# EAGLE design namcogunpcb (EAGLE 9.4.2)
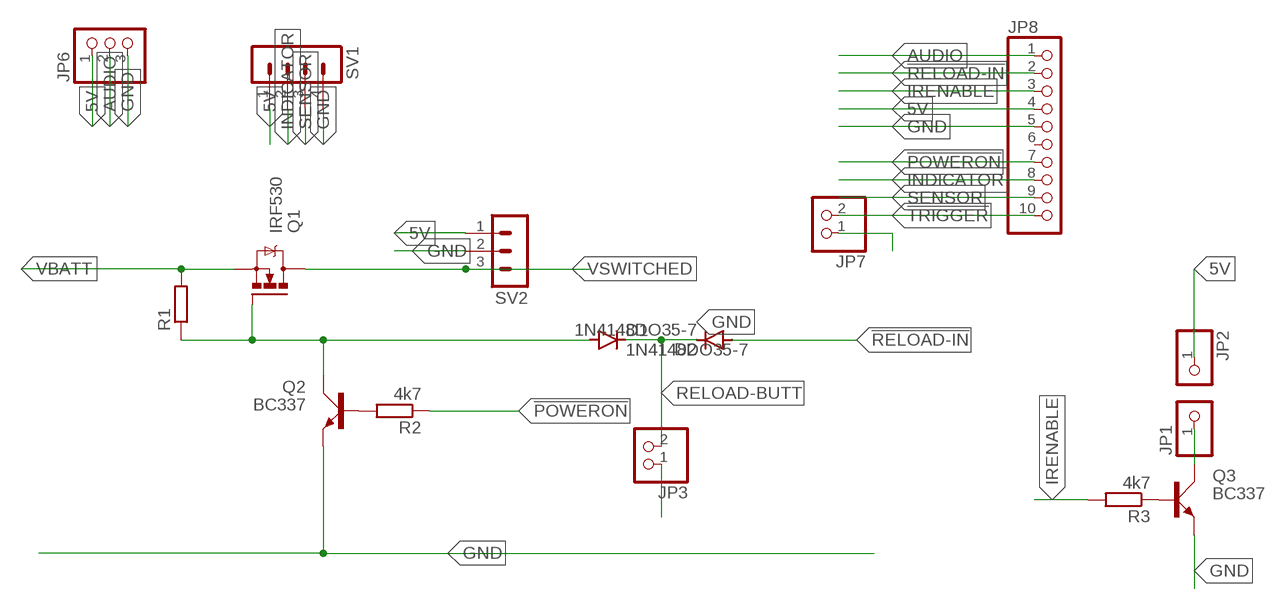
[diagram p0: schematic, sheet 1]

## Parts
D1  1N4148DO35-7  [DO35-7]
D2  1N4148DO35-7  [DO35-7]
JP1  PINHD-1X1  [1X01]
JP2  PINHD-1X1  [1X01]
JP3  PINHD-1X2  [1X02]
JP6  PINHD-1X3  [1X03]
JP7  PINHD-1X2  [1X02]
JP8  PINHD-1X10  [1X10]
Q1  IRF530  [TO220BV]
Q2  BC337  [SOT54A]
Q3  BC337  [SOT54A]
R1  R-EU_0207/10  [0207/10]
R2  4k7  R-EU_0207/10  [0207/10]
R3  4k7  R-EU_0207/10  [0207/10]
SV1  MA04-1  [MA04-1]
SV2  MA03-1  [MA03-1]

## Nets
5V: JP2.1 JP6.1 JP8.4 SV1.1 SV2.1
!POWERON: JP8.7 R2.1
!RELOAD-IN: D2.A JP8.2
!TRIGGER: JP7.2 JP8.10
AUDIO: JP6.2 JP8.1
GND: JP3.1 JP6.3 JP7.1 JP8.5 Q2.E Q3.E SV1.4 SV2.2
INDICATOR: JP8.8 SV1.2
IRENABLE: JP8.3 R3.2
N$1: JP1.1 Q3.C
N$2: D1.A Q1.G Q2.C R1.1
N$3: Q3.B R3.1
N$4: Q2.B R2.2
RELOAD-BUTT: D1.C D2.C JP3.2
SENSOR: JP8.9 SV1.3
VBATT: Q1.S R1.2
VSWITCHED: Q1.D SV2.3
Unconnected: JP8.6

## Library data of the parts
D1 D2 = diode:1N4148: DIODE high speed (Philips)
JP1 JP2 = pinhead:PINHD-1X1: PIN HEADER
JP3 JP7 = pinhead:PINHD-1X2: PIN HEADER
JP6 = adafruit:PINHD-1X3: PIN HEADER
JP8 = pinhead:PINHD-1X10: PIN HEADER
Q1 = transistor-power:IRF530: HEXFET Power MOSFET
Q2 Q3 = transistor-small-signal:BC337: NPN TRANSISTOR
R1-R3 = resistor:R-EU_: RESISTOR, European symbol
SV1 = con-lstb:MA04-1: PIN HEADER; OC_FARNELL: unknown; OC_NEWARK: unknown
SV2 = con-lstb:MA03-1: PIN HEADER; OC_FARNELL: unknown; OC_NEWARK: unknown

## Board
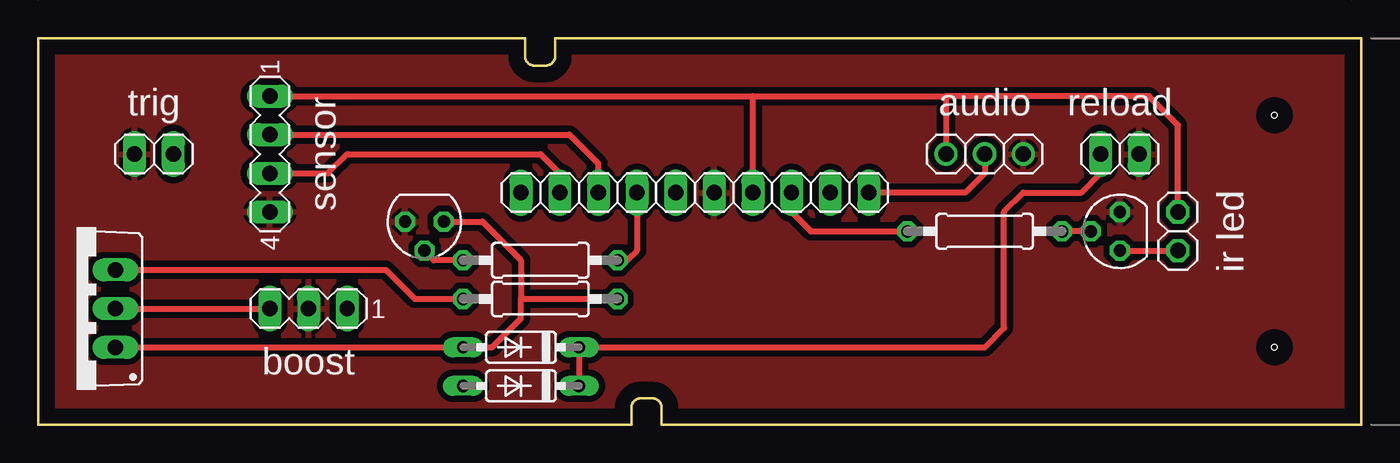
[diagram p1: board, top side]
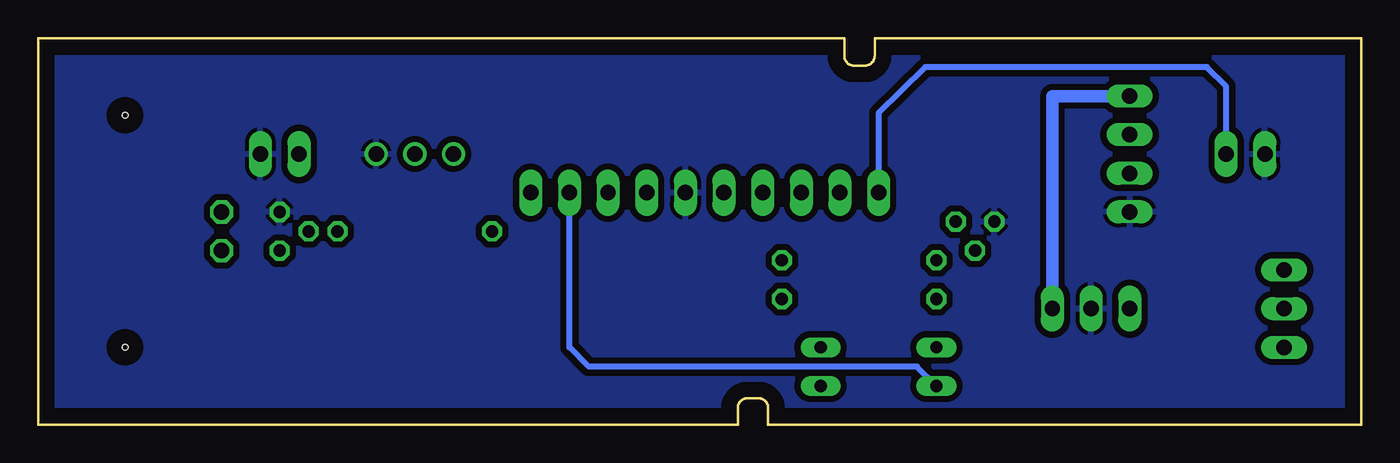
[diagram p2: board, bottom side, seen from below]

Size 87 x 25.4 mm. Coordinates in mm from the lower left corner, seen from the top.
Outline: 0,0 39,0 39,1.09 arc-90 39.63,1.73 40.37,1.73 arc-90 41,1.09 41,0 87,0 87,25.4 34,25.4 34,24.22 arc-90 33.37,23.59 32.63,23.59 arc-90 32,24.22 32,25.4 0,25.4 0,0
Copper layers (1*16): Top 0.035mm / dielectric 1.5mm / Bottom 0.035mm
Design rules "default": minimum track width 6mil, minimum drill 0.35mm, track to track 6mil, track to pad 6mil, pad to pad 6mil, via to via 6mil, smd to smd 6mil, copper to edge 40mil, drill to drill 6mil, minimum pad ring 10mil, minimum via ring 8mil, stop-mask expansion 4mil, vias tented up to drill 0mil, thermal gap 10mil
Holes 0.35 mm at 81.28,20.32 81.28,5.08

### Footprints (pad centres in the part's own frame; a part is rotated, then mirrored left to right if it is on the bottom)
DO35-7 = drill 0.813 long: A 3.81,0; C -3.81,0
1X01 = drill 1.016 octagon: 1 0,0
1X02 = drill 1.016 long: 1 -1.27,0; 2 1.27,0
1X03 = drill 1.016: 1 -2.54,0; 2 0,0; 3 2.54,0
1X10 = drill 1.016 long: 1 -11.43,0; 2 -8.89,0; 3 -6.35,0; 4 -3.81,0; 5 -1.27,0; 6 1.27,0; 7 3.81,0; 8 6.35,0; 9 8.89,0; 10 11.43,0
TO220BV = drill 1.016 long: D 0,-2.54; G -2.54,-2.54; S 2.54,-2.54
SOT54A = drill 0.813 octagon: B 0,1.905; C -1.27,0; E 1.27,0
0207/10 = drill 0.813 octagon: 1 -5.08,0; 2 5.08,0
MA04-1 = drill 1.016 long: 1 -3.81,0; 2 -1.27,0; 3 1.27,0; 4 3.81,0
MA03-1 = drill 1.016 long: 1 -2.54,0; 2 0,0; 3 2.54,0

### Placement (x,y rotation side)
D1  31.75,5.08 180 top
D2  31.75,2.54 180 top
JP1  74.93,11.43 0 top
JP2  74.93,13.97 0 top
JP3  71.12,17.78 180 top
JP6  62.23,17.78 0 top
JP7  7.62,17.78 0 top
JP8  43.18,15.24 180 top
Q1  2.54,7.62 90 top
Q2  25.4,13.34 180 top
Q3  71.12,12.7 90 top
R1  33.02,8.26 180 top
R2  33.02,10.79 180 top
R3  62.23,12.7 180 top
SV1  15.24,17.78 270 top
SV2  17.78,7.62 180 top

### Tracks (layer width: path | path; a pad name or v marks a point on that pad's centre or on a via)
5V
  Top 0.406: JP2.1 74.93,19.68 73.03,21.59 59.69,21.59 | 59.69,21.59 JP6.1 | SV1.1 46.99,21.59 | JP8.4 46.99,21.59 | 46.99,21.59 59.69,21.59
  Bottom 0.813: SV1.1 20.32,21.59 SV2.1
!POWERON
  Top 0.406: R2.1 38.73,10.79 39.37,11.43 JP8.7
!RELOAD-IN
  Bottom 0.406: D2.A 29.21,3.81 50.8,3.81 52.07,5.08 JP8.2
!TRIGGER
  Bottom 0.406: JP7.2 8.89,22.23 10.16,23.5 28.67,23.5 31.75,20.45 JP8.10
AUDIO
  Top 0.406: JP6.2 62.23,16.51 60.96,15.24 JP8.1
GND
  pour Top (isolate 0.406): 0,25.4 86.36,25.4 86.36,0 0,0
  pour Bottom (isolate 0.406): 0,25.4 86.36,25.4 86.36,0 0,0
INDICATOR
  Top 0.406: SV1.2 34.92,19.05 36.83,17.14 JP8.8
IRENABLE
  Top 0.406: JP8.3 49.53,13.97 50.8,12.7 R3.2
N$1
  Top 0.406: Q3.C JP1.1
N$2
  Top 0.406: Q1.G D1.A 29.84,5.08 31.75,6.99 31.75,8.26 | 31.75,8.26 R1.1 | Q2.C 29.21,13.34 31.75,10.79 31.75,8.26
N$3
  Top 0.406: Q3.B R3.1
N$4
  Top 0.406: R2.2 26.04,10.79 Q2.B
RELOAD-BUTT
  Top 0.406: D2.C D1.C 62.23,5.08 63.5,6.35 63.5,13.97 64.77,15.24 68.58,15.24 69.85,16.51 JP3.2
SENSOR
  Top 0.406: SV1.3 19.05,16.51 20.32,17.78 33.02,17.78 34.29,16.51 JP8.9
VBATT
  Top 0.406: Q1.S 22.86,10.16 24.77,8.26 R1.2
VSWITCHED
  Top 0.406: Q1.D SV2.3

### Text on the board
tPlace: trig | audio | reload | sensor | ir led | boost